# EAGLE schematic LissajousRevA (EAGLE 6.5.0)
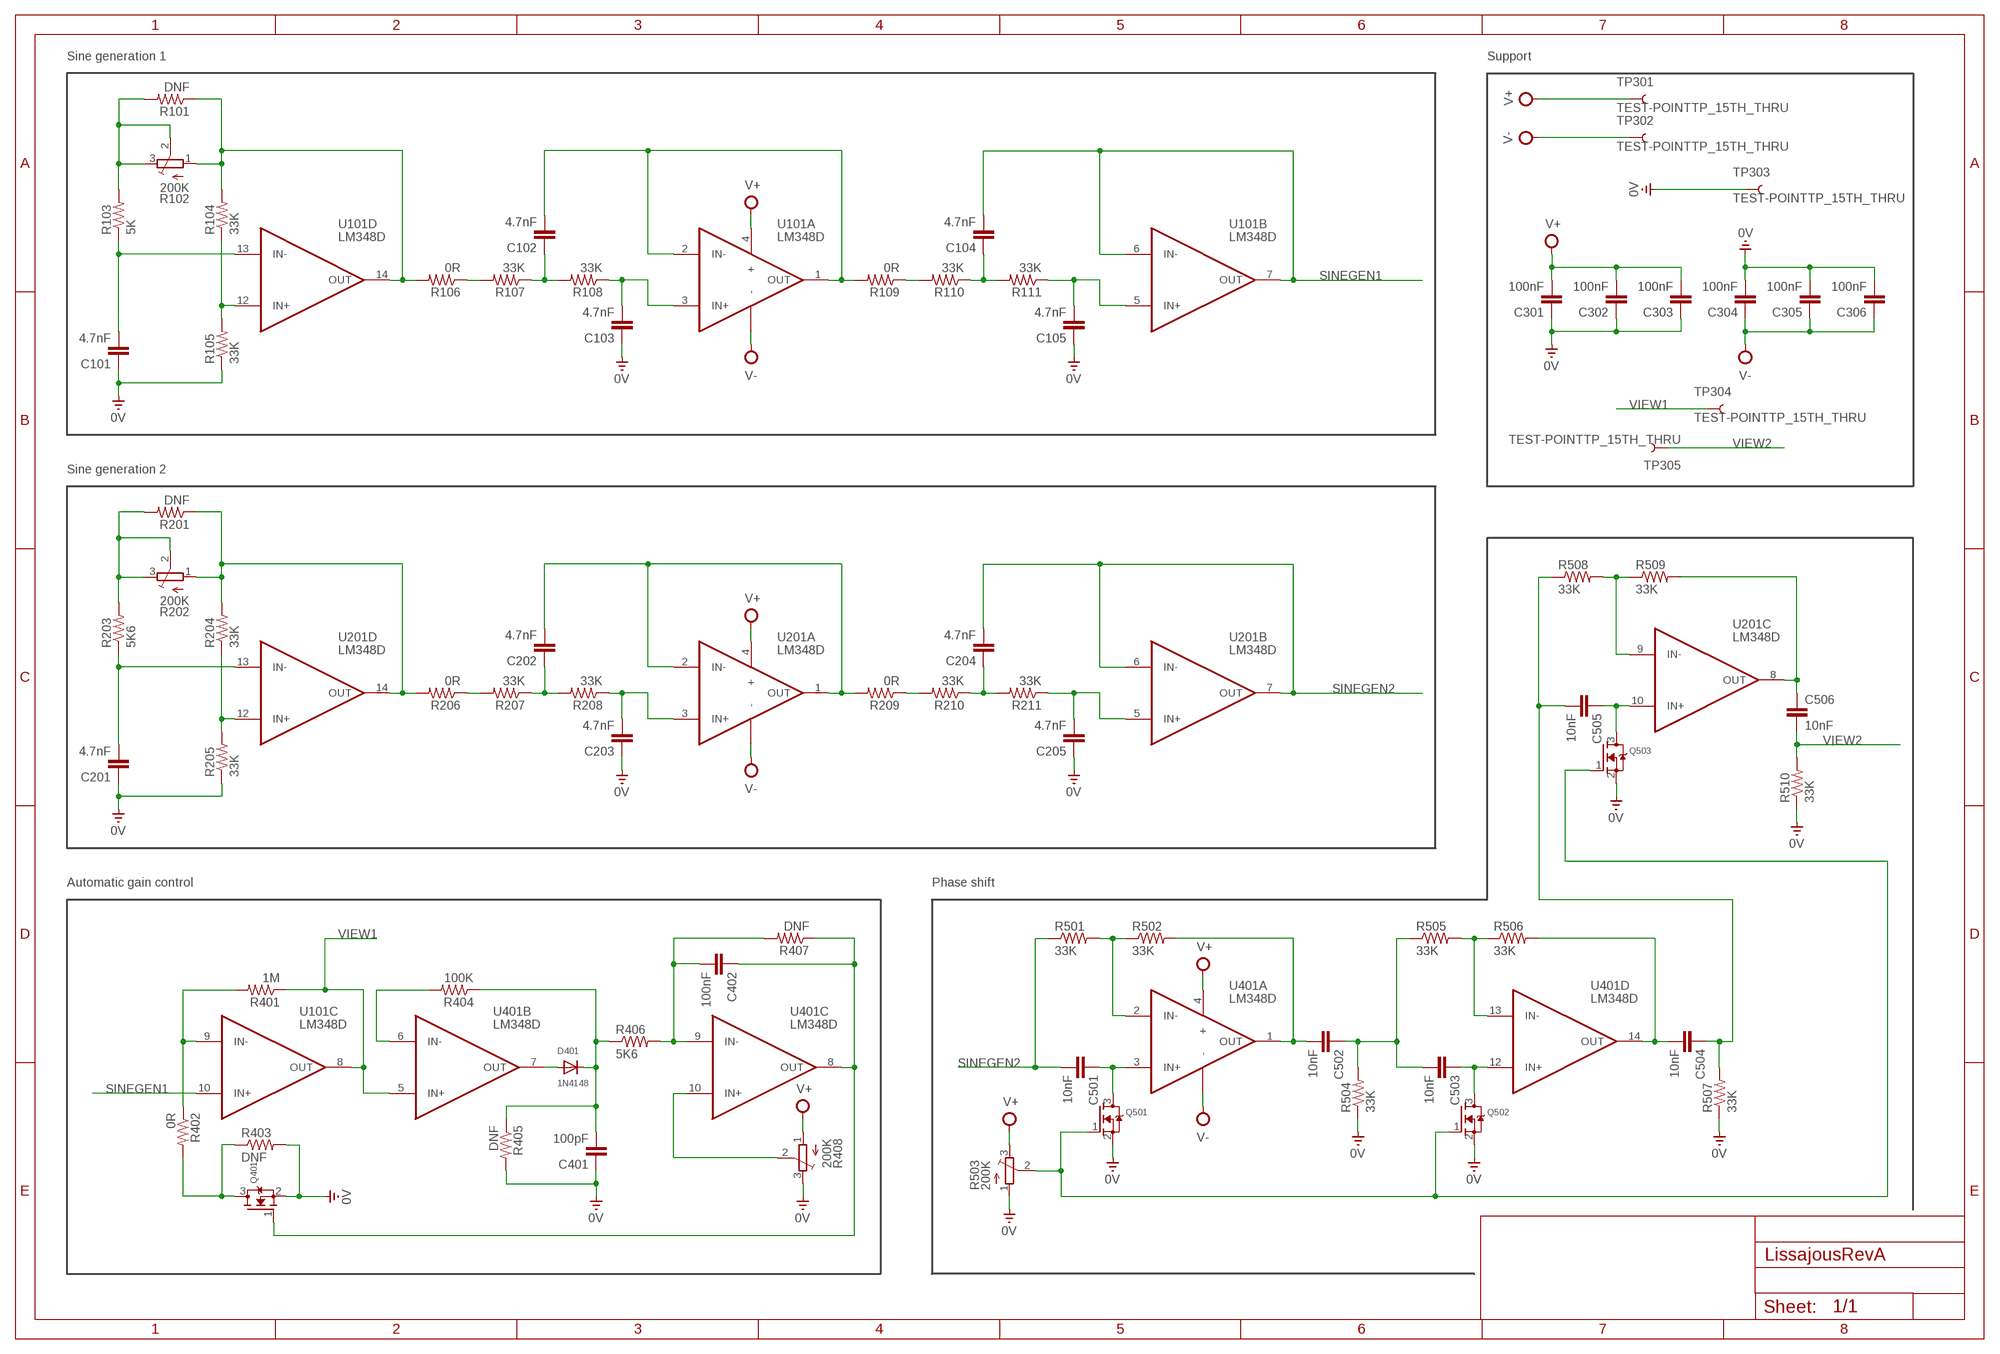
[diagram p0: schematic, sheet 1]

## Parts
C101  4.7nF  CAP0603-CAP  [0603-CAP]
C102  4.7nF  CAP0603-CAP  [0603-CAP]
C103  4.7nF  CAP0603-CAP  [0603-CAP]
C104  4.7nF  CAP0603-CAP  [0603-CAP]
C105  4.7nF  CAP0603-CAP  [0603-CAP]
C201  4.7nF  CAP0603-CAP  [0603-CAP]
C202  4.7nF  CAP0603-CAP  [0603-CAP]
C203  4.7nF  CAP0603-CAP  [0603-CAP]
C204  4.7nF  CAP0603-CAP  [0603-CAP]
C205  4.7nF  CAP0603-CAP  [0603-CAP]
C301  100nF  CAP0603-CAP  [0603-CAP]
C302  100nF  CAP0603-CAP  [0603-CAP]
C303  100nF  CAP0603-CAP  [0603-CAP]
C304  100nF  CAP0603-CAP  [0603-CAP]
C305  100nF  CAP0603-CAP  [0603-CAP]
C306  100nF  CAP0603-CAP  [0603-CAP]
C401  100pF  CAP0603-CAP  [0603-CAP]
C402  100nF  CAP0603-CAP  [0603-CAP]
C501  10nF  CAP0603-CAP  [0603-CAP]
C502  10nF  CAP0603-CAP  [0603-CAP]
C503  10nF  CAP0603-CAP  [0603-CAP]
C504  10nF  CAP0603-CAP  [0603-CAP]
C505  10nF  CAP0603-CAP  [0603-CAP]
C506  10nF  CAP0603-CAP  [0603-CAP]
D401  1N4148  DIODESMA  [SMADIODE]
Q401  MOSFET-NREFLOW  [SOT23]
Q501  MOSFET-NREFLOW  [SOT23]
Q502  MOSFET-NREFLOW  [SOT23]
Q503  MOSFET-NREFLOW  [SOT23]
R101  DNF  RESISTOR0603-RES  [0603-RES]
R102  200K  TRIMPOTTC33X  [TC33X]
R103  5K  RESISTOR0603-RES  [0603-RES]
R104  33K  RESISTOR0603-RES  [0603-RES]
R105  33K  RESISTOR0603-RES  [0603-RES]
R106  0R  RESISTOR0603-RES  [0603-RES]
R107  33K  RESISTOR0603-RES  [0603-RES]
R108  33K  RESISTOR0603-RES  [0603-RES]
R109  0R  RESISTOR0603-RES  [0603-RES]
R110  33K  RESISTOR0603-RES  [0603-RES]
R111  33K  RESISTOR0603-RES  [0603-RES]
R201  DNF  RESISTOR0603-RES  [0603-RES]
R202  200K  TRIMPOTTC33X  [TC33X]
R203  5K6  RESISTOR0603-RES  [0603-RES]
R204  33K  RESISTOR0603-RES  [0603-RES]
R205  33K  RESISTOR0603-RES  [0603-RES]
R206  0R  RESISTOR0603-RES  [0603-RES]
R207  33K  RESISTOR0603-RES  [0603-RES]
R208  33K  RESISTOR0603-RES  [0603-RES]
R209  0R  RESISTOR0603-RES  [0603-RES]
R210  33K  RESISTOR0603-RES  [0603-RES]
R211  33K  RESISTOR0603-RES  [0603-RES]
R401  1M  RESISTOR0603-RES  [0603-RES]
R402  0R  RESISTOR0603-RES  [0603-RES]
R403  DNF  RESISTOR0603-RES  [0603-RES]
R404  100K  RESISTOR0603-RES  [0603-RES]
R405  DNF  RESISTOR0603-RES  [0603-RES]
R406  5K6  RESISTOR0603-RES  [0603-RES]
R407  DNF  RESISTOR0603-RES  [0603-RES]
R408  200K  TRIMPOTTC33X  [TC33X]
R501  33K  RESISTOR0603-RES  [0603-RES]
R502  33K  RESISTOR0603-RES  [0603-RES]
R503  200K  TRIMPOTTC33X  [TC33X]
R504  33K  RESISTOR0603-RES  [0603-RES]
R505  33K  RESISTOR0603-RES  [0603-RES]
R506  33K  RESISTOR0603-RES  [0603-RES]
R507  33K  RESISTOR0603-RES  [0603-RES]
R508  33K  RESISTOR0603-RES  [0603-RES]
R509  33K  RESISTOR0603-RES  [0603-RES]
R510  33K  RESISTOR0603-RES  [0603-RES]
TP301  TEST-POINTTP_15TH_THRU  [TP_15TH]
TP302  TEST-POINTTP_15TH_THRU  [TP_15TH]
TP303  TEST-POINTTP_15TH_THRU  [TP_15TH]
TP304  TEST-POINTTP_15TH_THRU  [TP_15TH]
TP305  TEST-POINTTP_15TH_THRU  [TP_15TH]
U101  LM348D  [SOIC127P600X175-14N]
U201  LM348D  [SOIC127P600X175-14N]
U401  LM348D  [SOIC127P600X175-14N]

## Nets
0V: C101.1 C103.1 C105.1 C201.1 C203.1 C205.1 C301.1 C302.1 C303.1 C304.2 C305.2 C306.2 C401.1 Q401.2(S) Q501.2(S) Q502.2(S) Q503.2(S) R105.1 R205.1 R403.2 R405.2 R408.3(E) R503.1(A) R504.1 R507.1 R510.1 TP303.P$1
N$1: C101.2 R103.1 U101.13(D:IN-)
N$2: R104.1 R105.2 U101.12(D:IN+)
N$3: R106.1 R107.2
N$4: R101.2 R102.2(S) R102.3(E) R103.2
N$5: C103.2 R108.1 U101.3(A:IN+)
N$6: C102.1 R107.1 R108.2
N$7: R101.1 R102.1(A) R104.2 R106.2 U101.14(D:OUT)
N$8: C102.2 R109.2 U101.1(A:OUT) U101.2(A:IN-)
N$9: R204.1 R205.2 U201.12(D:IN+)
N$10: C201.2 R203.1 U201.13(D:IN-)
N$11: C105.2 R111.1 U101.5(B:IN+)
N$12: C104.1 R110.1 R111.2
N$13: R401.2 R402.1 U101.9(C:IN-)
N$14: R109.1 R110.2
N$15: R201.1 R202.1(A) R204.2 R206.2 U201.14(D:OUT)
N$16: C203.2 R208.1 U201.3(A:IN+)
N$17: C202.1 R207.1 R208.2
N$18: C205.2 R211.1 U201.5(B:IN+)
N$19: C204.1 R210.1 R211.2
N$20: C501.1 Q501.3(D) U401.3(A:IN+)
N$21: C202.2 R209.2 U201.1(A:OUT) U201.2(A:IN-)
N$22: R206.1 R207.2
N$23: R209.1 R210.2
N$24: R201.2 R202.2(S) R202.3(E) R203.2
N$25: C402.2 R406.2 R407.2 U401.9(C:IN-)
N$26: R501.2 R502.1 U401.2(A:IN-)
N$27: R404.2 U401.6(B:IN-)
N$28: D401.A U401.7(B:OUT)
N$29: C502.1 C503.2 R504.2 R505.1
N$30: C401.2 D401.C R404.1 R405.1 R406.1
N$31: Q401.3(D) R402.2 R403.1
N$32: C402.1 Q401.1(G) R407.1 U401.8(C:OUT)
N$33: C502.2 R502.2 U401.1(A:OUT)
N$34: R408.2(S) U401.10(C:IN+)
N$36: C503.1 Q502.3(D) U401.12(D:IN+)
N$37: R505.2 R506.1 U401.13(D:IN-)
N$38: Q501.1(G) Q502.1(G) Q503.1(G) R503.2(S)
N$39: C504.2 R506.2 U401.14(D:OUT)
N$40: R508.2 R509.1 U201.9(C:IN-)
N$42: C504.1 C505.2 R507.2 R508.1
N$45: C505.1 Q503.3(D) U201.10(C:IN+)
N$46: C506.1 R509.2 U201.8(C:OUT)
SINEGEN1: C104.2 U101.6(B:IN-) U101.7(B:OUT) U101.10(C:IN+)
SINEGEN2: C204.2 C501.2 R501.1 U201.6(B:IN-) U201.7(B:OUT)
V+: C301.2 C302.2 C303.2 R408.1(A) R503.3(E) TP301.P$1 U101.4(A:+) U201.4(A:+) U401.4(A:+)
V-: C304.1 C305.1 C306.1 TP302.P$1 U101.11(A:-) U201.11(A:-) U401.11(A:-)
VIEW1: R401.1 TP304.P$1 U101.8(C:OUT) U401.5(B:IN+)
VIEW2: C506.2 R510.2 TP305.P$1

## Notes on the sheet
- Sine generation 1 | Support
- Sine generation 2
- Automatic gain control | Phase shift

## Library data of the parts
C101-C105 C201-C205 C301-C306 C401 C402 C501-C506 = passives:CAP: Capacitor Standard 0603 ceramic capacitor, and 0.1" leaded capacitor.
D401 = adafruit:DIODE: Diode SMADIODE - SMA Surface Mount Package 20V 1A Schottky Diode Digikey: 641-1014-6-ND DO-1N4148 - Through Hole Small Current Diode SOD-123 20V 1 A (.5mV Vf) Schottky Diode - Digikey: MBRX120TPMSCT-ND SOD-323 10V 570mA (.38mV Vf, 3ns) Schottky Diode - Digikey: ZLLS410CT-ND SOD-523 30V 30mA Schottky Diode (RB751S-40TE61) - Digikey: RB751S-40TE61CT-ND SOT23-R/W - SOT23 Package (R = Solder Paste/Reflow Ovens, W = Hand-Soldering) BAT54Film 40V 300mA - Digikey: 497-7162-1-ND
Q401 Q501-Q503 = adafruit:MOSFET-N: N-Channel Mosfet 2N7002E - 60V 260mA SOT23 [Digikey: 2N7002ET1GOSTR-ND] - REEL BSH103 - 30V 850mA SOT23 [Digikey: 568-5013-1-ND]
R101 R103-R111 R201 R203-R211 R401-R407 R501 R502 R504-R510 = passives:RESISTOR: Resistor Basic schematic elements and footprints for 0603, 1206, and PTH resistors.
R102 R202 R408 R503 = adafruit:TRIMPOT: SMT trimmer potentiometer part number TC33X http://www.ladyada.net/library/eagle
TP301-TP305 = passives:TEST-POINT: Bare copper test points for troubleshooting or ICT
U101 U201 U401 = LM348D:LM348D: JFET-INPUT QUAD OPERATIONAL AMPLIFIERS; MPN: LM348D; OC_FARNELL: 9589635; OC_NEWARK: 06F9414; PACKAGE: SOIC-14; SUPPLIER: Texas Instruments